# Altium schematic sheet POWER.SchDoc
size A4
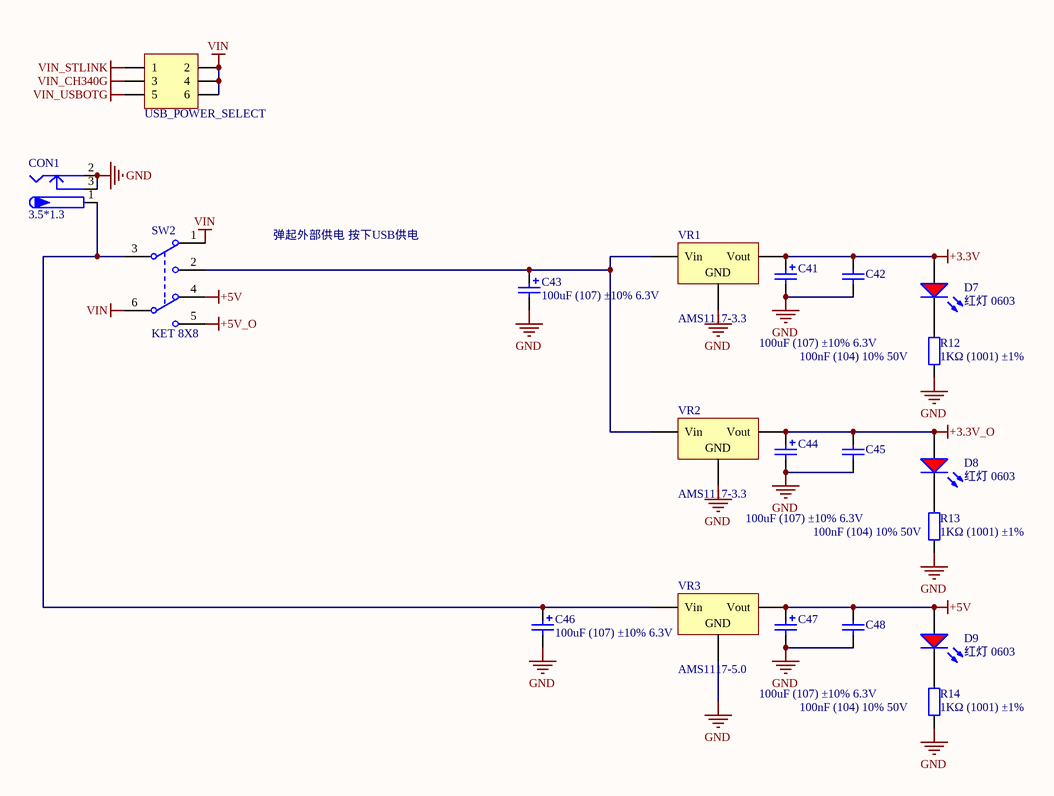
[diagram p0: POWER.SchDoc]

## Parts
C41  100uF (107) ±10% 6.3V  [CASE-B_3528]
C42  100nF (104) 10% 50V  [0603_C]
C43  100uF (107) ±10% 6.3V  [CASE-B_3528]
C44  100uF (107) ±10% 6.3V  [CASE-B_3528]
C45  100nF (104) 10% 50V  [0603_C]
C46  100uF (107) ±10% 6.3V  [CASE-B_3528]
C47  100uF (107) ±10% 6.3V  [CASE-B_3528]
C48  100nF (104) 10% 50V  [0603_C]
CON1  3.5*1.3  [DC-005]
D7  红灯 0603  [0603_LED_S1]
D8  红灯 0603  [0603_LED_S1]
D9  红灯 0603  [0603_LED_S1]
R12  1KΩ (1001) ±1%  [0603_R]
R13  1KΩ (1001) ±1%  [0603_R]
R14  1KΩ (1001) ±1%  [0603_R]
SW2  KET 8X8  [KFT DIP-8X8]
USB_POWER_SELECT  Header3X2  [HDR2.54-LI-2x3P]  (value not drawn)
VR1  AMS1117-3.3  [SOT-223]
VR2  AMS1117-3.3  [SOT-223]
VR3  AMS1117-5.0  [SOT-223]

## Nets
+3.3V: C41.1 C42.2 D7.A VR1.2(Vout)
+3.3V_O: C44.1 C45.2 D8.A VR2.2(Vout)
+5V: C47.1 C48.2 D9.A SW2.4(NO2) VR3.2(Vout)
+5V_O: SW2.5(COM2)
GND: C41.2 C42.1 C43.2 C44.2 C45.1 C46.2 C47.2 C48.1 CON1.2 CON1.3 R12.1 R13.1 R14.1 VR1.1(GND) VR2.1(GND) VR3.1(GND)
VIN: SW2.1(NC1) SW2.6(NC2) USB_POWER_SELECT.2 USB_POWER_SELECT.4 USB_POWER_SELECT.6
VIN_CH340G: USB_POWER_SELECT.3
VIN_STLINK: USB_POWER_SELECT.1
VIN_USBOTG: USB_POWER_SELECT.5
NetC43_1: C43.1 SW2.2(COM2) VR1.3(Vin) VR2.3(Vin)
NetC46_1: C46.1 CON1.1 SW2.3(NO1) VR3.3(Vin)
NetD7_K: D7.K R12.2
NetD8_K: D8.K R13.2
NetD9_K: D9.K R14.2

## Notes on the sheet
- 弹起外部供电 按下USB供电

## Library data of the parts
C41 C43 C44 C46 C47 = 3528 100uF (107) 10% 6.3V: 钽电容; ComponentLink1Description: 供应商链接; ComponentLink1URL: http://www.szlcsc.com/product/details_16815.html; Package: 3528; Supplier: LC; SuppliersPartNumber: C16133
C42 C45 C48 = 0603 100nF (104) 10% 50V: 贴片电容; ComponentLink1Description: 供应商链接; ComponentLink1URL: http://www.szlcsc.com/product/details_15331.html; Package: 0603; Supplier: LC; SuppliersPartNumber: C14663
CON1 = P-DC: 低压电源接口; BOM名称: DC电源接口; 版权归属: 源创客; 学习资源: www.ooocke.com
D7-D9 = 0603 红灯: 发光二极管; ComponentLink1Description: 供应商链接; ComponentLink1URL: http://www.szlcsc.com/product/details_2659.html; Package: 0603; Supplier: LC; SuppliersPartNumber: C2286
R12-R14 = 0603 1KΩ (1001) 1%: 贴片电阻; ComponentLink1Description: 供应商链接; ComponentLink1URL: http://www.szlcsc.com/product/details_21904.html; Package: 0603; Supplier: LC; SuppliersPartNumber: C21190
SW2 = KET 8X8: 8*8自锁开关; 版权归属: 源创客; BOM名称: 8*8自锁开关; 学习资源: www.ooocke.com
USB_POWER_SELECT = Header 3X2: 3*2P接插件; 版权归属: 源创客; BOM名称: 3*2P接插件; 学习资源: www.ooocke.com
VR1 VR2 = SOT-223 AMS1117-3.3: 低压差线性稳压(LDO); ComponentLink1Description: 供应商链接; ComponentLink1URL: http://www.szlcsc.com/product/details_6652.html; Package: SOT-223; Supplier: LC; SuppliersPartNumber: C6186
VR3 = SOT-223 AMS1117-5.0: 低压差线性稳压(LDO); ComponentLink1Description: 供应商链接; ComponentLink1URL: http://www.szlcsc.com/product/details_6653.html; Package: SOT-223; Supplier: LC; SuppliersPartNumber: C6187